# EAGLE design TDT_BreakoutBrd (EAGLE 7.6.0)

## Sheet 1 of 3
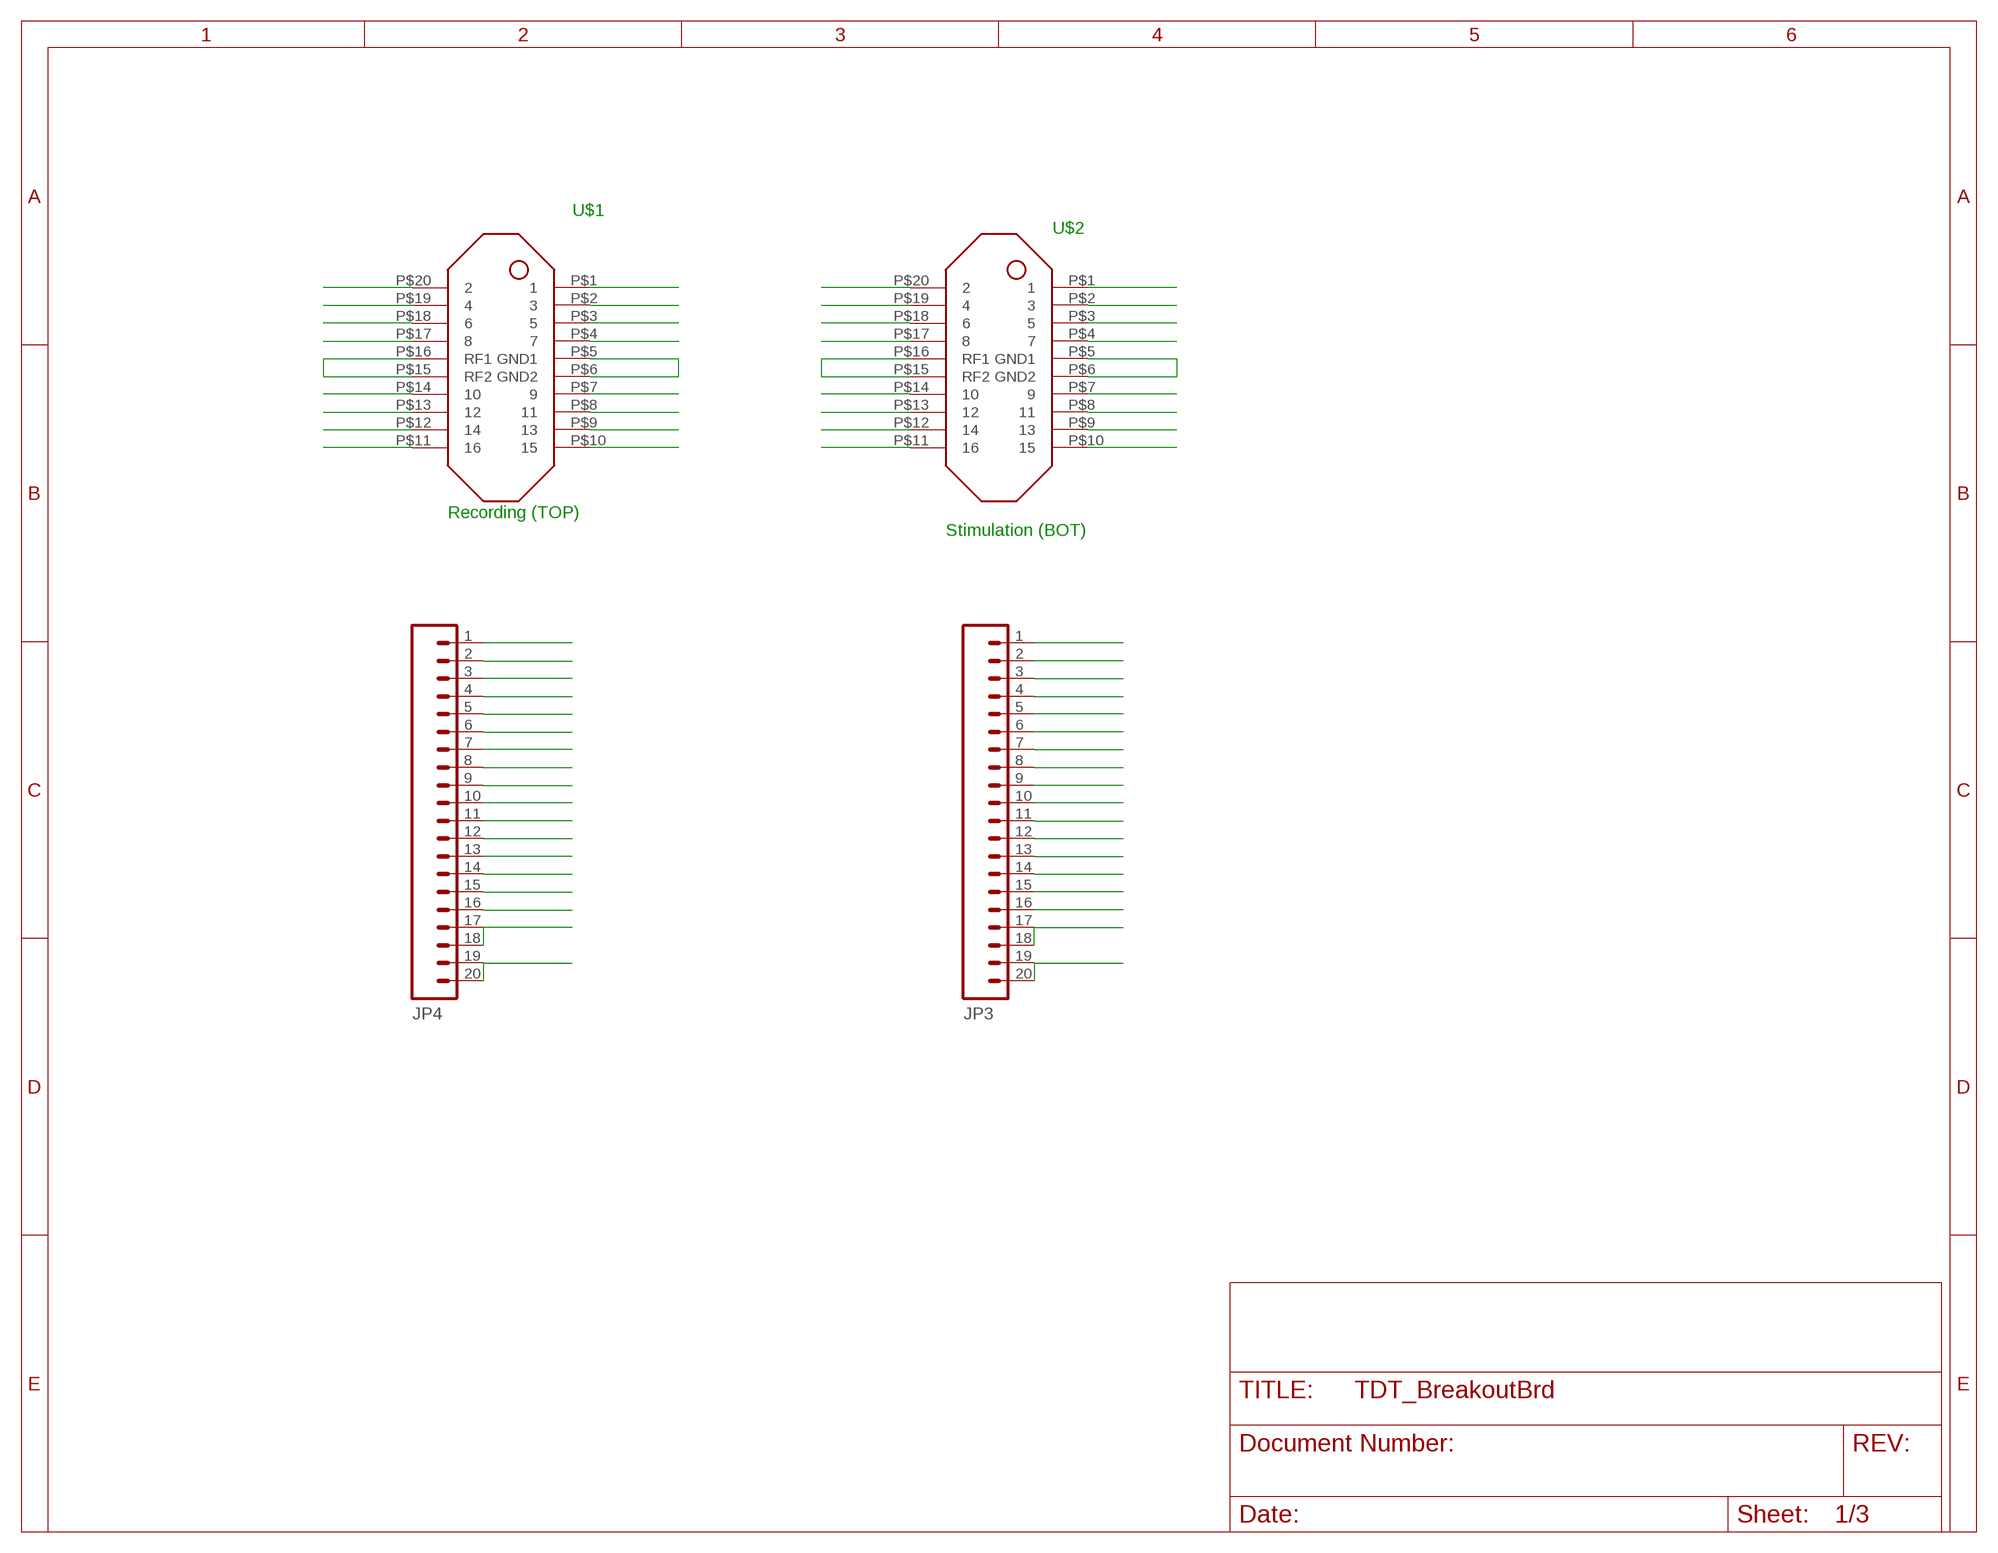
[diagram p0: schematic, sheet 1]

### Parts
JP3  M20  [1X20]
JP4  M20  [1X20]
U$1  DF30_HEADER  [DF30FC-20DP-0.4V]
U$2  DF30_HEADER  [DF30FC-20DP-0.4V]

### Nets
B1: JP3.2 U$2.P$1
B2: JP3.1 U$2.P$20
B3: JP3.4 U$2.P$2
B4: JP3.3 U$2.P$19
B5: JP3.6 U$2.P$3
B6: JP3.5 U$2.P$18
B7: JP3.8 U$2.P$4
B8: JP3.7 U$2.P$17
B9: JP3.10 U$2.P$7
B10: JP3.9 U$2.P$14
B11: JP3.12 U$2.P$8
B12: JP3.11 U$2.P$13
B13: JP3.14 U$2.P$9
B14: JP3.13 U$2.P$12
B15: JP3.16 U$2.P$10
B16: JP3.15 U$2.P$11
BG1: JP3.19 JP3.20 U$2.P$5(GND1) U$2.P$6(GND2)
BRF1: JP3.17 JP3.18 U$2.P$15(RF2) U$2.P$16(RF1)
T1: JP4.1 U$1.P$1
T2: JP4.2 U$1.P$20
T3: JP4.3 U$1.P$2
T4: JP4.4 U$1.P$19
T5: JP4.5 U$1.P$3
T6: JP4.6 U$1.P$18
T7: JP4.7 U$1.P$4
T8: JP4.8 U$1.P$17
T9: JP4.9 U$1.P$7
T10: JP4.10 U$1.P$14
T11: JP4.11 U$1.P$8
T12: JP4.12 U$1.P$13
T13: JP4.13 U$1.P$9
T14: JP4.14 U$1.P$12
T15: JP4.15 U$1.P$10
T16: JP4.16 U$1.P$11
TG1: JP4.19 JP4.20 U$1.P$5(GND1) U$1.P$6(GND2)
TRF1: JP4.17 JP4.18 U$1.P$15(RF2) U$1.P$16(RF1)

### Notes on the sheet
- U$1
- U$2
- Recording (TOP)
- Stimulation (BOT)

## Sheet 2 of 3

## Sheet 3 of 3

## Library data of the parts
JP3 JP4 = SparkFun-Connectors:M20: 1x20 .1" header This is just like the LOCK variant in that the holes are staggared by 5 mil, but except for the last two holes. They are not altered from the "standard" footprint layout. This is used for a special purpose on the layout of our Graphic LCD Backpack. Make sure you want to use this device before selecting it for you project!
U$1 U$2 = TDT_Connectors:DF30_HEADER

## Board
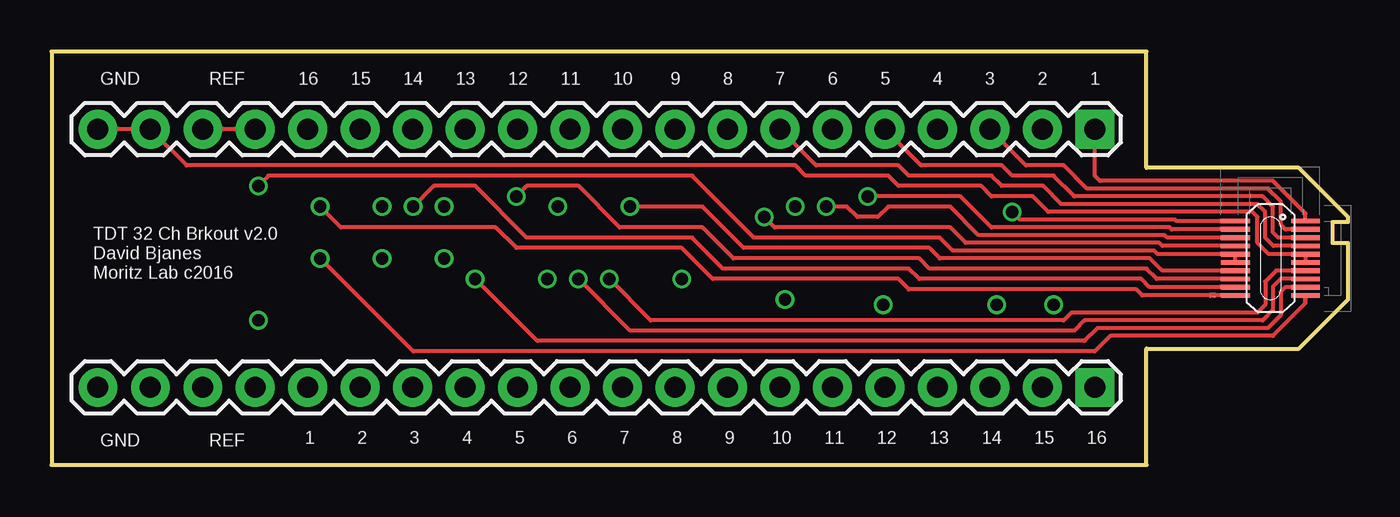
[diagram p1: board, top side]
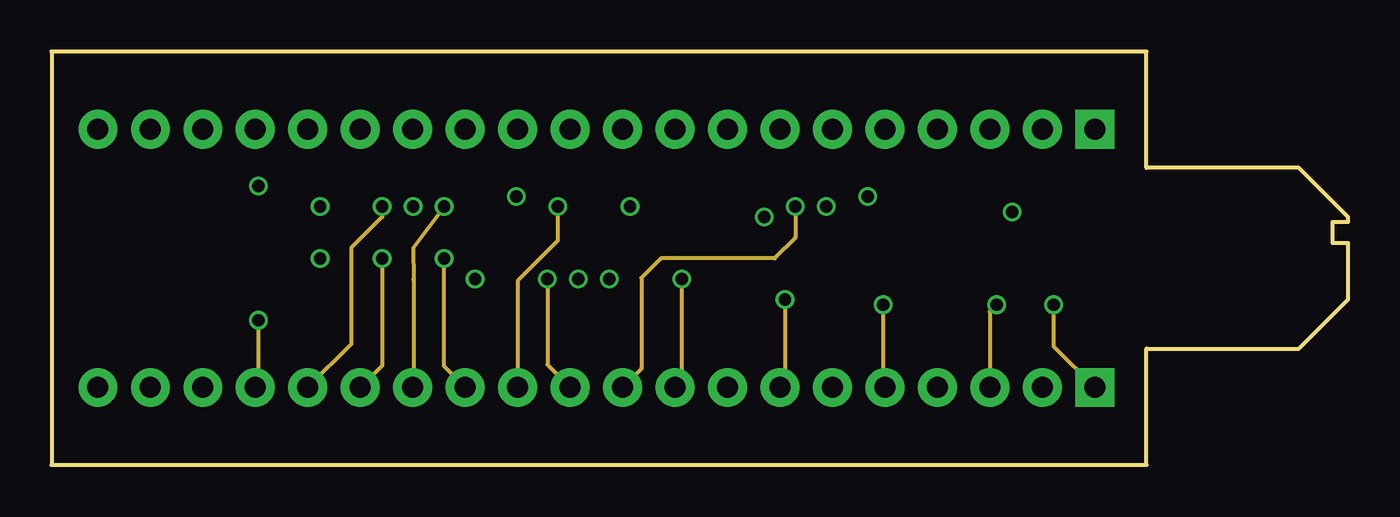
[diagram p2: board, inner layer Route2]
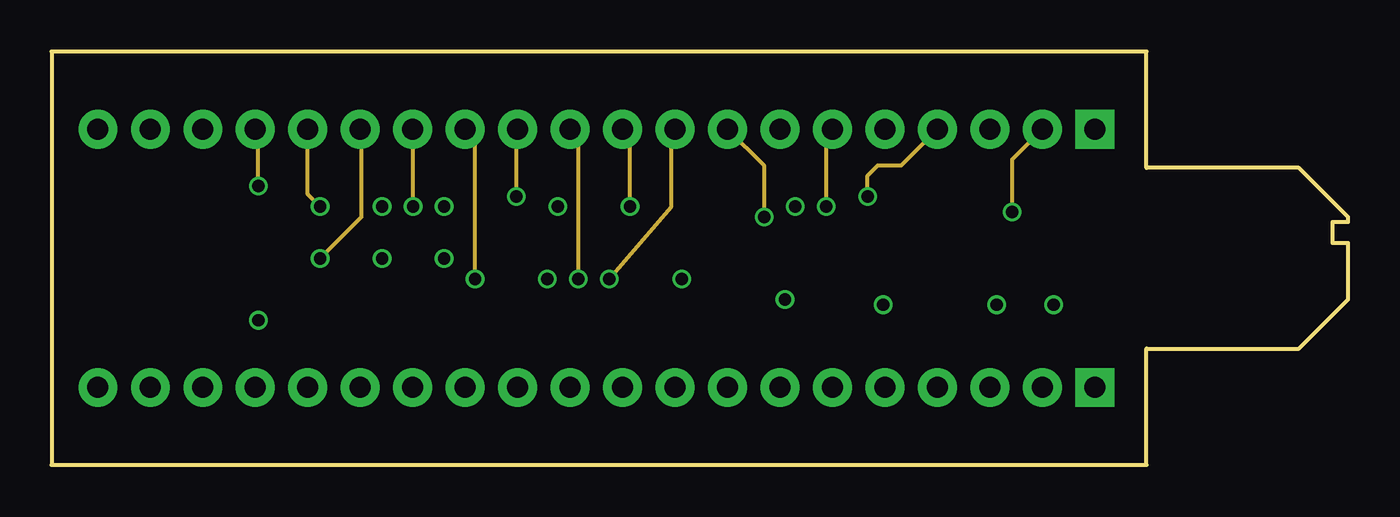
[diagram p3: board, inner layer Route15]
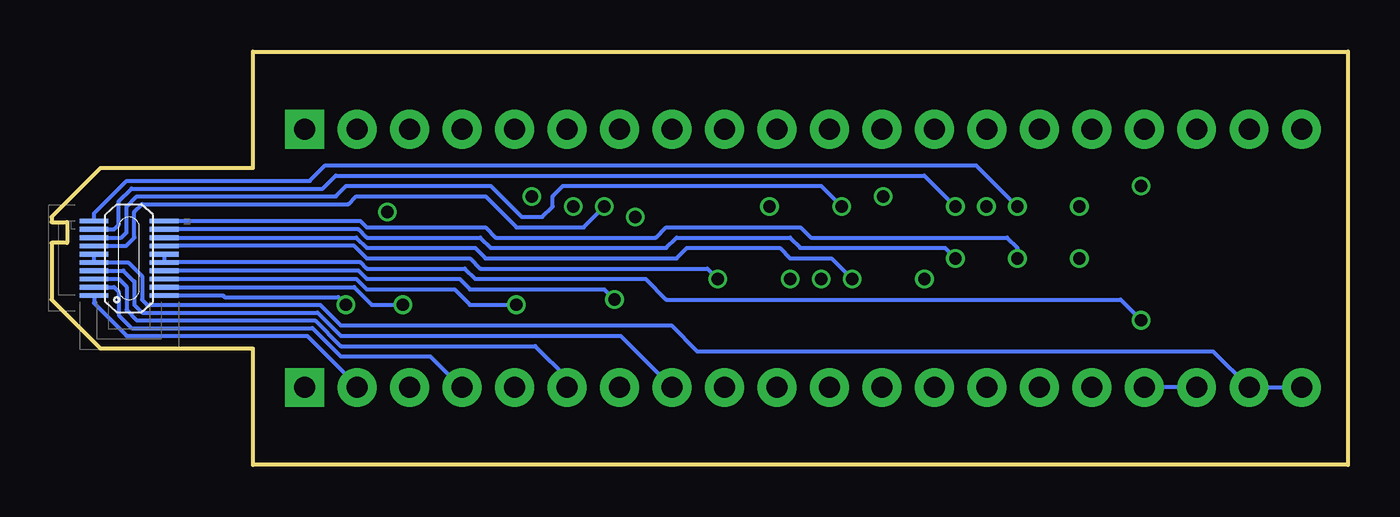
[diagram p4: board, bottom side, seen from below]

Size 62.75 x 20 mm. Coordinates in mm from the lower left corner, seen from the top.
Outline: 60.38,14.38 53,14.38 53,20 0,20 0,0 53,0 53,5.62 60.38,5.62 62.75,8 62.75,10.75 62,10.75 62,11.75 62.75,11.75 62.75,12 60.38,14.38
Copper layers (1*2*15*16): Top 0.035559375mm / dielectric 0.17018125mm / Route2 0.01778125mm / dielectric 47mil / Route15 0.01778125mm / dielectric 0.17018125mm / Bottom 0.035559375mm
Design rules "OSHPark-4layer": minimum track width 5mil, minimum drill 10mil, track to track 5mil, track to pad 5mil, pad to pad 5mil, via to via 5mil, smd to smd 5mil, copper to edge 15mil, drill to drill 6mil, minimum pad ring 4mil, minimum via ring 4mil, stop-mask expansion 2.5mil, vias tented up to drill 0mil, thermal gap 10mil

### Footprints (pad centres in the part's own frame; a part is rotated, then mirrored left to right if it is on the bottom)
1X20 = drill 1.016 pad 1.88 square: 1 0,0 | drill 1.016 pad 1.88: 2 2.54,0; 3 5.08,0; 4 7.62,0; 5 10.16,0; 6 12.7,0; 7 15.24,0; 8 17.78,0; 9 20.32,0; 10 22.86,0; 11 25.4,0; 12 27.94,0; 13 30.48,0; 14 33.02,0; 15 35.56,0; 16 38.1,0; 17 40.64,0; 18 43.18,0; 19 45.72,0; 20 48.26,0
DF30FC-20DP-0.4V = smd 0.23 x 1.4: P$1 -1.8,1.7; P$2 -1.4,1.7; P$3 -1,1.7; P$4 -0.6,1.7; P$5 -0.2,1.7; P$6 0.2,1.7; P$7 0.6,1.7; P$8 1,1.7; P$9 1.4,1.7; P$10 1.8,1.7; P$11 1.8,-1.7; P$12 1.4,-1.7; P$13 1,-1.7; P$14 0.6,-1.7; P$15 0.2,-1.7; P$16 -0.2,-1.7; P$17 -0.6,-1.7; P$18 -1,-1.7; P$19 -1.4,-1.7; P$20 -1.8,-1.7

### Placement (x,y rotation side)
JP3  50.5,3.75 180 top
JP4  50.5,16.25 180 top
U$1  59,10 270 top
U$2  59,10 90 bottom

### Tracks (layer width: path | path; a pad name or v marks a point on that pad's centre or on a via)
B1
  Bottom 0.203: U$2.P$1 60.7,7.83 59.12,6.25 50.38,6.25 47.96,3.83 JP3.2
B2  (via drill 0.6)
  Route2 0.203: v48.5,7.75 48.5,5.75 JP3.1
  Bottom 0.203: U$2.P$20 54.45,8.2 54.38,8.12 48.88,8.12 v48.5,7.75
B3
  Bottom 0.203: U$2.P$2 59.73,8.6 59.5,8.38 59.5,7.25 58.88,6.62 50.12,6.62 48.75,5.25 44.42,5.25 42.92,3.75 JP3.4
B4  (via drill 0.6)
  Route2 0.203: v45.75,7.75 45.42,7.42 JP3.3
  Bottom 0.203: U$2.P$19 48.1,8.6 47.25,7.75 v45.75,7.75
B5
  Bottom 0.203: U$2.P$3 59.5,9 59.12,8.62 59.12,7.5 58.62,7 50,7 48.75,5.75 39.34,5.75 37.8,4.21 JP3.6
B6  (via drill 0.6)
  Route2 0.203: v40.25,7.75 40.25,3.84 | 40.25,3.84 40.25,3.8 | JP3.5 40.25,3.84
  Bottom 0.203: v40.25,7.75 42.5,7.75 43.25,8.5 47.5,8.5 48,9 U$2.P$18
B7
  Bottom 0.203: U$2.P$4 59.27,9.4 58.75,8.88 58.75,7.75 58.38,7.38 49.88,7.38 48.75,6.25 35.22,6.25 JP3.8
B8  (via drill 0.6)
  Route2 0.203: v35.5,8 35.5,3.99 JP3.7
  Bottom 0.203: v35.5,8 36,8.5 42.5,8.5 43,9 47.5,9 47.9,9.4 U$2.P$17
B9  (via drill 0.6)
  Route2 0.203: v36,12.5 36,11 35,10 29.5,10 28.55,9.05 28.55,4.67 JP3.10
  Bottom 0.203: U$2.P$7 59.15,10.6 58.75,11 58.75,12.25 58.38,12.62 48.38,12.62 48,13 41.75,13 40.25,11.5 37,11.5 v36,12.5
B10  (via drill 0.6)
  Route2 0.203: v30.5,9 30.5,4.07 JP3.9
  Bottom 0.203: v30.5,9 31,9.5 42,9.5 42.5,10 47.5,10 48.1,10.6 U$2.P$14
B11  (via drill 0.6)
  Route2 0.203: v24.5,12.5 24.5,10.85 22.56,8.91 JP3.12
  Bottom 0.203: U$2.P$8 59.38,11 59.12,11.25 59.12,12.5 58.62,13 49,13 48.5,13.5 41.5,13.5 40,12 39,12 38.5,12.5 38.5,13 38,13.5 25.5,13.5 v24.5,12.5
B12  (via drill 0.6)
  Route2 0.203: v24,9 24,4.85 JP3.11
  Bottom 0.203: v24,9 25,10 27,10 27.5,10.5 32,10.5 32.5,10 41.75,10 42.25,10.5 47.5,10.5 48,11 U$2.P$13
B13  (via drill 0.6)
  Route2 0.203: v19,12.5 17.5,10.5 17.52,8.98 17.52,3.79 JP3.14
  Bottom 0.203: U$2.P$9 59.73,11.4 59.5,11.62 59.5,12.75 58.88,13.38 49.62,13.38 49,14 20.5,14 v19,12.5
B14  (via drill 0.6)
  Route2 0.203: v19,10 18.98,9.52 18.98,4.79 JP3.13
  Bottom 0.203: v19,10 19.5,10.5 26.5,10.5 27,11 32.5,11 33,10.5 41.5,10.5 42,11 47.5,11 47.9,11.4 U$2.P$12
B15  (via drill 0.6)
  Route2 0.203: v16,12.5 16,12 14.5,10.5 14.5,5.85 JP3.16
  Bottom 0.203: U$2.P$10 60.7,12.18 59.12,13.75 50.25,13.75 49.5,14.5 18,14.5 v16,12.5
B16  (via drill 0.6)
  Route2 0.203: v16,10 16,4.81 JP3.15
  Bottom 0.203: v16,10 16,10.5 16.5,11 26,11 26.5,11.5 33,11.5 33.5,11 41.25,11 41.75,11.5 47.5,11.5 47.8,11.8 U$2.P$11
BG1
  Bottom 0.203: U$2.P$6 U$2.P$5 59.05,9.8 58.38,9.12 58.38,8 58.12,7.75 49.75,7.75 48.75,6.75 32.75,6.75 31.5,5.5 6.53,5.5 JP3.19 JP3.20
BRF1  (via drill 0.6)
  Route2 0.203: v10,7 10,3.89 9.86,3.89 JP3.17
  Bottom 0.203: U$2.P$15 U$2.P$16 47.8,9.8 47.5,9.5 42.75,9.5 42.25,9 34,9 33,8 11,8 v10,7 | JP3.18 JP3.17
T1
  Top 0.203: U$1.P$1 60.7,12.18 59.12,13.75 50.75,13.75 50.5,14 JP4.1
T2  (via drill 0.6)
  Top 0.203: U$1.P$20 54.45,11.8 54.38,11.88 46.88,11.88 v46.5,12.25
  Route15 0.203: v46.5,12.25 46.5,14.79 JP4.2
T3
  Top 0.203: U$1.P$2 59.73,11.4 59.5,11.62 59.5,12.75 58.88,13.38 50.12,13.38 49,14.5 47.17,14.5 JP4.3
T4  (via drill 0.6)
  Top 0.203: U$1.P$19 54.23,11.4 54.12,11.5 45.5,11.5 44,13 v39.5,13
  Route15 0.203: v39.5,13 39.5,14 40,14.5 41.13,14.5 JP4.4
T5
  Top 0.203: U$1.P$3 59.38,11 59.12,11.25 59.12,12.5 58.62,13 49.5,13 48.5,14 46.5,14 46,14.5 42.09,14.5 JP4.5
T6  (via drill 0.6)
  Top 0.203: U$1.P$18 54,11 53.88,11.12 44.88,11.12 43.5,12.5 40.5,12.5 40,12 39,12 38.5,12.5 v37.5,12.5
  Route15 0.203: v37.5,12.5 37.5,15.95 JP4.6
T7
  Top 0.203: U$1.P$4 59.15,10.6 58.75,11 58.75,12.25 58.38,12.62 48.88,12.62 48,13.5 46,13.5 45.5,14 41.5,14 41,14.5 37.01,14.5 JP4.7
T8  (via drill 0.6)
  Top 0.203: U$1.P$17 53.77,10.6 53.62,10.75 44.25,10.75 43.5,11.5 35,11.5 v34.5,12
  Route15 0.203: v34.5,12 34.5,14.47 JP4.8
T9  (via drill 0.6)
  Top 0.203: U$1.P$7 59.27,9.4 58.75,8.88 58.75,7.75 58.38,7.38 49.38,7.38 49,7 29,7 v27,9
  Route15 0.203: v27,9 30,12.5 30,16.07 JP4.9
T10  (via drill 0.6)
  Top 0.203: U$1.P$14 53.77,9.4 53.17,10 43,10 42.5,10.5 33.5,10.5 31.5,12.5 v28,12.5
  Route15 0.203: v28,12.5 28,15.89 JP4.10
T11  (via drill 0.6)
  Top 0.203: U$1.P$8 59.5,9 59.12,8.62 59.12,7.5 58.62,7 50,7 49.5,6.5 28,6.5 v25.5,9
  Route15 0.203: v25.5,9 25.5,15.85 JP4.11
T12  (via drill 0.6)
  Top 0.203: U$1.P$13 53.5,9 53,9.5 42.5,9.5 42,10 33,10 31.5,11.5 27.5,11.5 25.5,13.5 23,13.5 v22.5,13
  Route15 0.203: v22.5,13 22.5,16.19 JP4.12
T13  (via drill 0.6)
  Top 0.203: U$1.P$9 59.73,8.6 59.5,8.38 59.5,7.25 58.88,6.62 50.62,6.62 50,6 23.5,6 v20.5,9
  Route15 0.203: v20.5,9 20.5,15.73 JP4.13
T14  (via drill 0.6)
  Top 0.203: U$1.P$12 53.15,8.6 52.75,9 42,9 41.5,9.5 32.5,9.5 31,11 23,11 20.5,13.5 18.5,13.5 v17.5,12.5
  Route15 0.203: v17.5,12.5 17.5,16.23 JP4.14
T15  (via drill 0.6)
  Top 0.203: 60.7,7.95 U$1.P$10 60.7,7.83 59.12,6.25 51.25,6.25 50.5,5.5 17.5,5.5 v13,10
  Route15 0.203: v13,10 15,12 15,16.19 JP4.15
T16  (via drill 0.6)
  Top 0.203: U$1.P$11 52.8,8.2 52.5,8.5 41.5,8.5 41,9 32,9 30.5,10.5 22.5,10.5 21.5,11.5 14,11.5 v13,12.5
  Route15 0.203: v13,12.5 12.4,13.1 JP4.16
TG1
  Top 0.203: U$1.P$6 U$1.P$5 58.92,10.2 58.38,10.75 58.38,12 58.12,12.25 48.25,12.25 47.5,13 45.5,13 45,13.5 41,13.5 40.5,14 36.5,14 36,14.5 6.53,14.5 JP4.19 JP4.20
TRF1  (via drill 0.6)
  Top 0.203: v10,13.5 10.5,14 31,14 34,11 43,11 43.62,10.38 53.38,10.38 53.55,10.2 U$1.P$16 U$1.P$15 | JP4.17 JP4.18
  Route15 0.203: v10,13.5 10,16.11 JP4.17

### Text on the board
tNames: GND | REF | 16 | 15 | 14 | 13 | 12 | 11 | 10 | 9 | 8 | 7 | 6 | 5 | 4 | 3 | 2 | 1 | TDT 32 Ch Brkout v2.0 / David Bjanes / Moritz Lab c2016 | GND | REF | 1 | 2 | 3 | 4 | 5 | 6 | 7 | 8 | 9 | 10 | 11 | 12 | 13 | 14 | 15 | 16